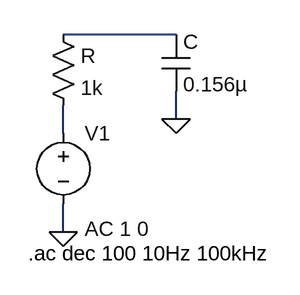
[diagram p0: schematic lowpass and bandpass.asc]
lowpass and bandpass.asc, the LTspice schematic file:
Version 4.1
SHEET 1 880 680
WIRE 304 128 176 128
WIRE 304 224 304 192
WIRE 176 240 176 208
WIRE 176 352 176 320
FLAG 304 224 0
FLAG 176 352 0
SYMBOL res 160 112 R0
SYMATTR InstName R
SYMATTR Value 1k
SYMATTR SpiceLine tol=1
SYMBOL cap 288 128 R0
SYMATTR InstName C
SYMATTR Value 0.156µ
SYMBOL voltage 176 224 R0
WINDOW 123 24 124 Left 2
WINDOW 39 0 0 Left 0
SYMATTR InstName V1
SYMATTR Value ""
SYMATTR Value2 AC 1 0
TEXT 136 376 Left 2 !.ac dec 100 10Hz 100kHz

The netlist it stands for:
* lowpass and bandpass.asc
R N001 N002 1k tol=1
C N001 0 0.156µ
V1 N002 0 AC 1 0
.ac dec 100 10Hz 100kHz
.backanno
.end